# EAGLE design completefilter (EAGLE 8.1.0)
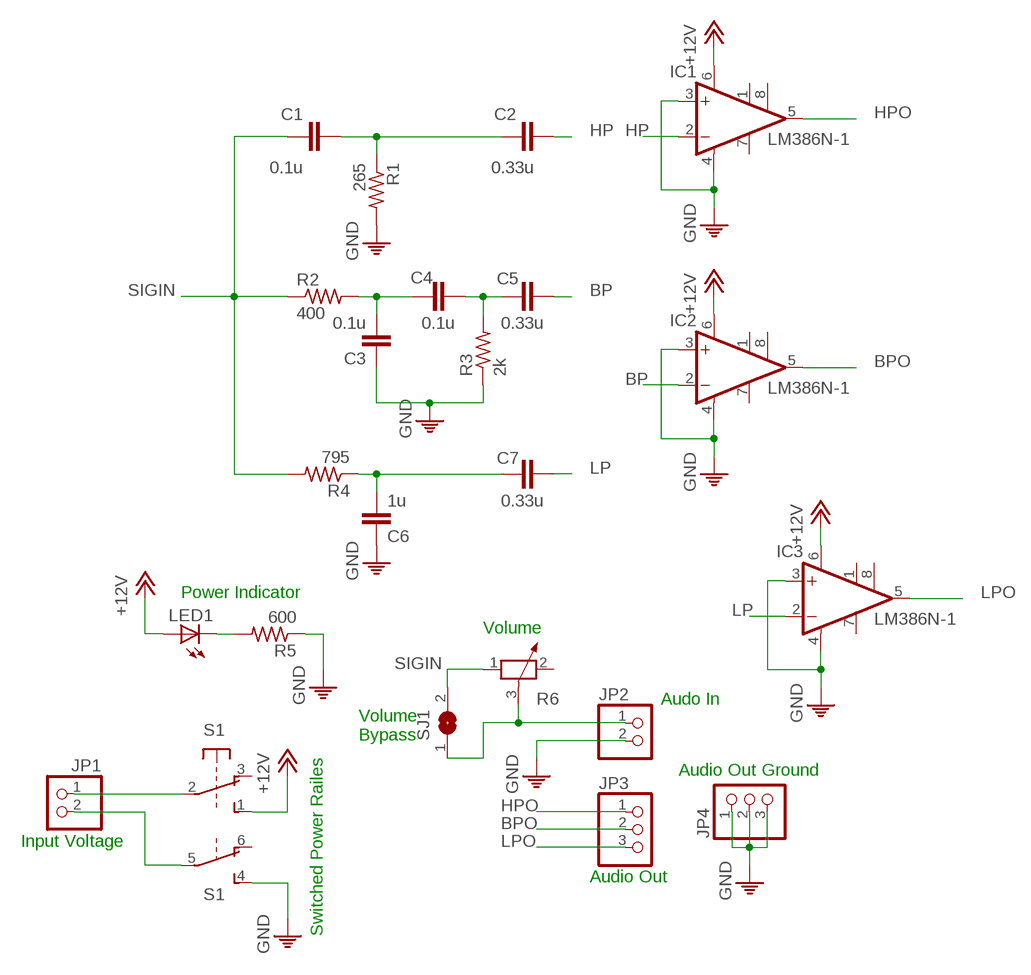
[diagram p0: schematic, sheet 1]

## Parts
C1  0.1u  C-EUC1206  [C1206]
C2  0.33u  C-EUC1206  [C1206]
C3  0.1u  C-EUC1206  [C1206]
C4  0.1u  C-EUC1206  [C1206]
C5  0.33u  C-EUC1206  [C1206]
C6  1u  C-EUC1206  [C1206]
C7  0.33u  C-EUC1206  [C1206]
IC1  LM386N-1  [DIL08]
IC2  LM386N-1  [DIL08]
IC3  LM386N-1  [DIL08]
JP1  PINHD-1X2  [1X02]
JP2  PINHD-1X2  [1X02]
JP3  PINHD-1X3  [1X03]
JP4  PINHD-1X3  [1X03]
LED1  LED3MM  [LED3MM]
R1  265  R-US_R1206  [R1206]
R2  400  R-US_R1206  [R1206]
R3  2k  R-US_R1206  [R1206]
R4  795  R-US_R1206  [R1206]
R5  600  R-US_R1206  [R1206]
R6  POTENTIOMETER_PT-10  [PT-10]
S1  9450-2  [9450-2]
SJ1  SJW  [SJW]

## Nets
+12V: IC1.6(VS) IC2.6(VS) IC3.6(VS) LED1.A S1.1(1:S)
BP: C5.1 IC2.2(-IN)
BPO: IC2.5(OUT) JP3.2
GND: C3.1 C6.1 IC1.3(+IN) IC1.4(GND) IC2.3(+IN) IC2.4(GND) IC3.3(+IN) IC3.4(GND) JP2.2 JP4.1 JP4.2 JP4.3 R1.2 R3.1 R5.1 S1.4(2:S)
GNDIN: JP1.2 S1.5(2:P)
HP: C2.2 IC1.2(-IN)
HPO: IC1.5(OUT) JP3.1
LP: C7.1 IC3.2(-IN)
LPO: IC3.5(OUT) JP3.3
N$1: C1.2 C2.1 R1.1
N$2: C3.2 C4.2 R2.2
N$3: C4.1 C5.2 R3.2
N$4: C6.2 C7.2 R4.1
N$6: LED1.K(C) R5.2
N$7: JP2.1 R6.3 SJ1.1
SIGIN: C1.1 R2.1 R4.2 R6.1 SJ1.2
VIN: JP1.1 S1.2(1:P)
Unconnected: IC1.1(GAIN) IC1.7(BYPASS) IC1.8(GAIN) IC2.1(GAIN) IC2.7(BYPASS) IC2.8(GAIN) IC3.1(GAIN) IC3.7(BYPASS) IC3.8(GAIN) R6.2 S1.3(1:O) S1.6(2:O)

## Notes on the sheet
- Power Indicator
- Volume
- Audo In
- Volume
  Bypass
- Audio Out Ground
- Input Voltage
- Audio Out
- Switched Power Railes

## Library data of the parts
C1-C7 = rcl:C-EU: CAPACITOR, European symbol
IC1-IC3 = linear:LM386?-*: Low Voltage Audio Power Amplifier Source: http://cache.national.com/ds/LM/LM386.pdf
JP1 JP2 = pinhead:PINHD-1X2: PIN HEADER
JP3 JP4 = pinhead:PINHD-1X3: PIN HEADER
LED1 = led:LED: LED OSRAM: - CHIPLED LG R971, LG N971, LY N971, LG Q971, LY Q971, LO R971, LY R971 LH N974, LH R974 LS Q976, LO Q976, LY Q976 LO Q996 - Hyper CHIPLED LW Q18S LB Q993, LB Q99A, LB R99A - SideLED LS A670, LO A670, LY A670, LG A670, LP A670 LB A673, LV A673, LT A673, LW A673 LH A674 LY A675 LS A676, LA A676, LO A676, LY A676, LW A676 LS A679, LY A679, LG A679 - Hyper Micro SIDELED® LS Y876, LA Y876, LO Y876, LY Y876 LT Y87S - SmartLED LW L88C, LW L88S LB L89C, LB L89S, LG L890 LS L89K, LO L89K, LY L89K LS L896, LA L896, LO L896, LY L896 - TOPLED LS T670, LO T670, LY T670, LG T670, LP T670 LSG T670, LSP T670, LSY T670, LOP T670, LYG T670 LG T671, LOG T671, LSG T671 LB T673, LV T673, LT T673, LW T673 LH T674 LS T676, LA T676, LO T676, LY T676, LB T676, LH T676, LSB T676, LW T676 LB T67C, LV T67C, LT T67C, LS T67K, LO T67K, LY T67K, LW E67C LS E67B, LA E67B, LO E67B, LY E67B, LB E67C, LV E67C, LT E67C LW T67C LS T679, LY T679, LG T679 LS T770, LO T770, LY T770, LG T770, LP T770 LB T773, LV T773, LT T773, LW T773 LH T774 LS E675, LA E675, LY E675, LS T675 LS T776, LA T776, LO T776, LY T776, LB T776 LHGB T686 LT T68C, LB T68C - Hyper Mini TOPLED® LB M676 - Mini TOPLED Santana® LG M470 LS M47K, LO M47K, LY M47K Source: http://www.osram.convergy.de LUXEON: - LUMILED® LXK2-PW12-R00, LXK2-PW12-S00, LXK2-PW14-U00, LXK2-PW14-V00 LXK2-PM12-R00, LXK2-PM12-S00, LXK2-PM14-U00 LXK2-PE12-Q00, LXK2-PE12-R00, LXK2-PE12-S00, LXK2-PE14-T00, LXK2-PE14-U00 LXK2-PB12-K00, LXK2-PB12-L00, LXK2-PB12-M00, LXK2-PB14-N00, LXK2-PB14-P00, LXK2-PB14-Q00 LXK2-PR12-L00, LXK2-PR12-M00, LXK2-PR14-Q00, LXK2-PR14-R00 LXK2-PD12-Q00, LXK2-PD12-R00, LXK2-PD12-S00 LXK2-PH12-R00, LXK2-PH12-S00 LXK2-PL12-P00, LXK2-PL12-Q00, LXK2-PL12-R00 Source: www.luxeon.com KINGBRIGHT: KA-3528ASYC Source: www.kingbright.com
R1-R5 = rcl:R-US_: RESISTOR, American symbol
R6 = rcl:POTENTIOMETER_: Potentiometer
S1 = switch-misc:9450-2: MARQUARDT SWITCH
SJ1 = jumper:SJ: SMD solder JUMPER

## Board
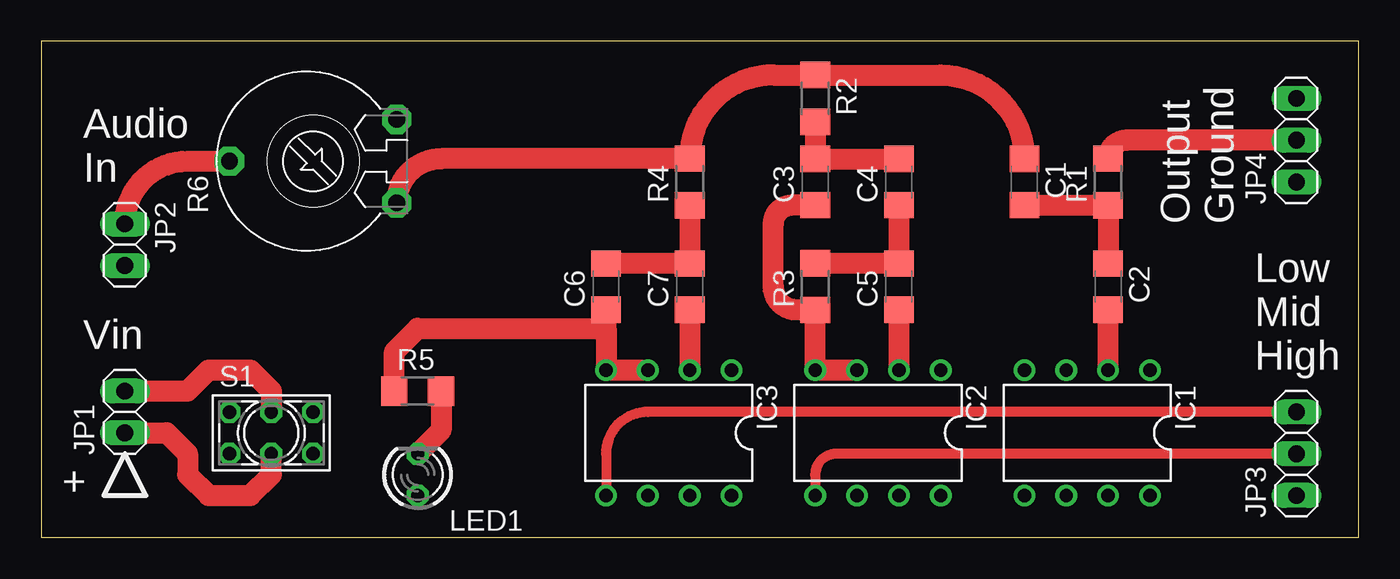
[diagram p1: board, top side]
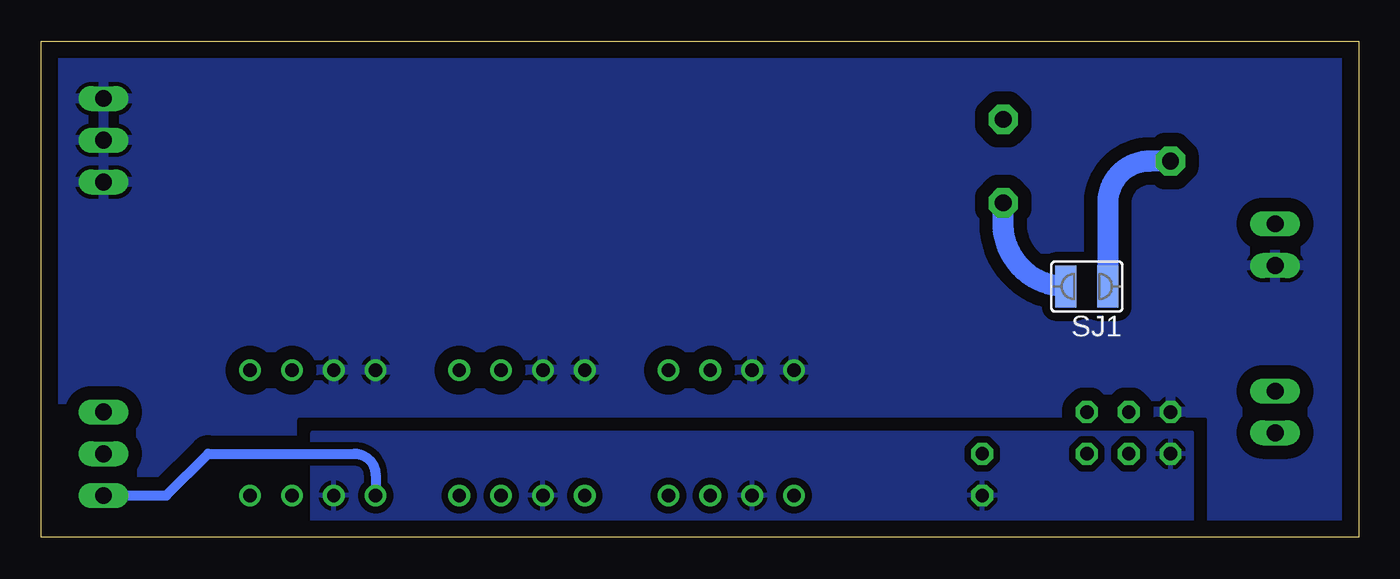
[diagram p2: board, bottom side, seen from below]

Size 79.99 x 30.15 mm. Coordinates in mm from the lower left corner, seen from the top.
Outline: 0,0 79.99,0 79.99,30.15 0,30.15 0,0
Copper layers (1*16): Top 0.035mm / dielectric 1.5mm / Bottom 0.035mm
Design rules "default": minimum track width 10mil, minimum drill 24mil, track to track 8mil, track to pad 8mil, pad to pad 8mil, via to via 8mil, smd to smd 8mil, copper to edge 40mil, drill to drill 8mil, minimum pad ring 10mil, minimum via ring 8mil, stop-mask expansion 4mil, vias tented up to drill 0mil, thermal gap 10mil

### Footprints (pad centres in the part's own frame; a part is rotated, then mirrored left to right if it is on the bottom)
C1206 = smd 1.6 x 1.8: 1 -1.4,0; 2 1.4,0
DIL08 = drill 0.813 pad 1.27: 1 -3.81,-3.81; 2 -1.27,-3.81; 3 1.27,-3.81; 4 3.81,-3.81; 5 3.81,3.81; 6 1.27,3.81; 7 -1.27,3.81; 8 -3.81,3.81
1X02 = drill 1.016 long: 1 -1.27,0; 2 1.27,0
1X03 = drill 1.016 long: 1 -2.54,0; 2 0,0; 3 2.54,0
LED3MM = drill 0.813 octagon: A -1.27,0; K 1.27,0
R1206 = smd 1.6 x 1.803: 1 -1.422,0; 2 1.422,0
PT-10 = drill 1.016 pad 1.778 octagon: 1 -2.54,-5.08; 2 2.54,-5.08; 3 0,5.08
9450-2 = drill 0.813 octagon: 1 -2.54,-1.27; 2 0,-1.27; 3 2.54,-1.27; 4 -2.54,1.27; 5 0,1.27; 6 2.54,1.27
SJW = smd 1.27 x 2.54: 1 -1.27,0; 2 1.27,0

### Placement (x,y rotation side)
C1  59.69,21.59 270 top
C2  64.77,15.24 270 top
C3  46.99,21.59 90 top
C4  52.07,21.59 90 top
C5  52.07,15.24 90 top
C6  34.29,15.24 90 top
C7  39.37,15.24 90 top
IC1  63.5,6.35 180 top
IC2  50.8,6.35 180 top
IC3  38.1,6.35 180 top
JP1  5.08,7.62 90 top
JP2  5.08,17.78 270 top
JP3  76.2,5.08 90 top
JP4  76.2,24.13 90 top
LED1  22.86,3.81 90 top
R1  64.77,21.59 90 top
R2  46.99,26.67 270 top
R3  46.99,15.24 90 top
R4  39.37,21.59 90 top
R5  22.86,8.89 0 top
R6  16.51,22.86 90 top
S1  13.97,6.35 0 top
SJ1  16.51,15.24 180 bottom

### Tracks (layer width: path | path; a pad name or v marks a point on that pad's centre or on a via)
+12V
  pour Bottom (isolate 0.406): 63.5,6.35 10.16,6.35 10.16,-1.27 63.5,-1.27
BP
  Top 1.27: C5.1 IC2.2
BPO
  Top 0.61: JP3.2 48.26,5.08 arc90 46.99,3.81 IC2.5
GND
  Top 1.27: 34.29,12.7 C6.1 | 34.29,12.7 IC3.4 IC3.3 | R5.1 21.44,11.28 22.86,12.7 34.29,12.7 | IC2.3 IC2.4 R3.1 45.87,13.82 arc-90 44.45,15.24 44.45,19.05 arc-90 45.59,20.19 C3.1 | R1.2 arc-90 65.89,24.13 JP4.2
  pour Bottom (isolate 0.813, rank 3): 81.28,-1.27 -1.27,-1.27 -1.27,6.35 -1.27,34.29 -1.27,35.56 81.28,35.56
GNDIN
  Top 1.27: JP1.2 8.89,8.89 10.16,10.16 12.7,10.16 13.97,8.89 S1.5
HP
  Top 1.27: IC1.2 C2.2
HPO
  Bottom 0.61: JP3.1 72.39,2.54 69.85,5.08 60.96,5.08 arc90 59.69,3.81 IC1.5
LP
  Top 1.27: C7.1 IC3.2
LPO
  Top 0.61: JP3.3 36.83,7.62 arc90 34.29,5.08 IC3.5
N$1
  Top 1.27: C2.1 R1.1 arc90 64.75,20.19 C1.2
N$2
  Top 1.27: C4.2 C3.2 R2.2
N$3
  Top 1.27: R3.2 52.05,16.66 C5.2 C4.1
N$4
  Top 1.27: C6.2 C7.2 R4.1
N$6
  Top 1.27: R5.2 24.28,6.5 LED1.K
N$7
  Top 1.27: JP2.1 arc-90 8.89,22.86 R6.3
  Bottom 1.27: R6.3 12.7,22.86 arc-90 15.24,20.32 SJ1.1
SIGIN
  Top 1.27: R6.1 arc-90 24.28,23.01 R4.2 arc-90 44.45,28.09 R2.1 54.59,28.09 arc-90 C1.1
  Bottom 1.27: SJ1.2 arc90 21.59,19.05 R6.1
VIN
  Top 1.27: JP1.1 7.62,6.35 8.89,5.08 8.89,3.81 10.16,2.54 12.7,2.54 13.97,3.81 S1.2

### Text on the board
tPlace: Audio / In | Output / Ground | Vin | Low / Mid / High | +